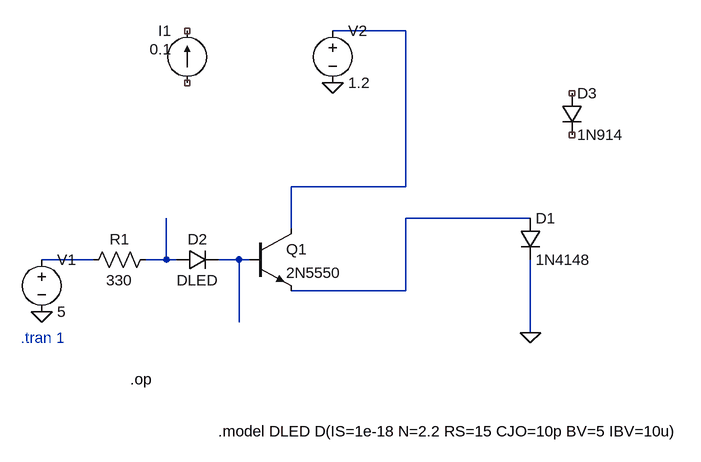
[diagram p0: schematic transistor_v2.asc]
transistor_v2.asc, the LTspice schematic file:
Version 4.1
SHEET 1 880 680
WIRE 336 -160 224 -160
WIRE 336 80 336 -160
WIRE 336 80 160 80
WIRE 528 128 336 128
WIRE 160 144 160 80
WIRE -144 192 -224 192
WIRE -32 192 -32 128
WIRE -32 192 -64 192
WIRE -16 192 -32 192
WIRE 80 192 48 192
WIRE 96 192 80 192
WIRE 336 240 336 128
WIRE 336 240 160 240
WIRE 80 288 80 192
WIRE 528 304 528 192
FLAG 224 -80 0
FLAG -224 272 0
FLAG 528 304 0
DATAFLAG 416 128 ""
DATAFLAG 176 80 ""
DATAFLAG -32 128 ""
DATAFLAG 80 288 ""
SYMBOL npn 96 144 R0
SYMATTR InstName Q1
SYMATTR Value 2N5550
SYMBOL res -48 176 R90
WINDOW 0 0 56 VBottom 2
WINDOW 3 32 56 VTop 2
SYMATTR InstName R1
SYMATTR Value 330
SYMBOL voltage -224 176 R0
WINDOW 123 0 0 Left 0
WINDOW 39 0 0 Left 0
SYMATTR InstName V1
SYMATTR Value 5
SYMBOL current 0 -80 R180
WINDOW 0 24 80 Left 2
WINDOW 3 24 52 Left 2
WINDOW 123 0 0 Left 0
WINDOW 39 0 0 Left 0
SYMATTR InstName I1
SYMATTR Value 0.1
SYMBOL diode 512 128 R0
SYMATTR InstName D1
SYMATTR Value 1N4148
SYMBOL diode -16 208 R270
WINDOW 0 32 32 VTop 2
WINDOW 3 0 32 VBottom 2
SYMATTR InstName D2
SYMATTR Value DLED
SYMBOL voltage 224 -176 R0
WINDOW 123 0 0 Left 0
WINDOW 39 0 0 Left 0
SYMATTR InstName V2
SYMATTR Value 1.2
SYMBOL diode 576 -64 R0
SYMATTR InstName D3
SYMATTR Value 1N914
TEXT -256 312 Left 2 ;.tran 1
TEXT -88 376 Left 2 !.op
TEXT 48 456 Left 2 !.model DLED D(IS=1e-18 N=2.2 RS=15 CJO=10p BV=5 IBV=10u)

The netlist it stands for:
* transistor_v2.asc
Q1 N001 N005 N002 0 2N5550
R1 N004 N003 330
V1 N003 0 5
I1 NC_01 NC_02 0.1
D1 N002 0 1N4148
D2 N004 N005 DLED
V2 N001 0 1.2
D3 NC_03 NC_04 1N914
.model D D
.lib standard.dio
.model NPN NPN
.model PNP PNP
.lib standard.bjt
* .tran 1
.op
.model DLED D(IS=1e-18 N=2.2 RS=15 CJO=10p BV=5 IBV=10u)
.backanno
.end